# EAGLE board adc (EAGLE 6.5.0), part 1 of 2
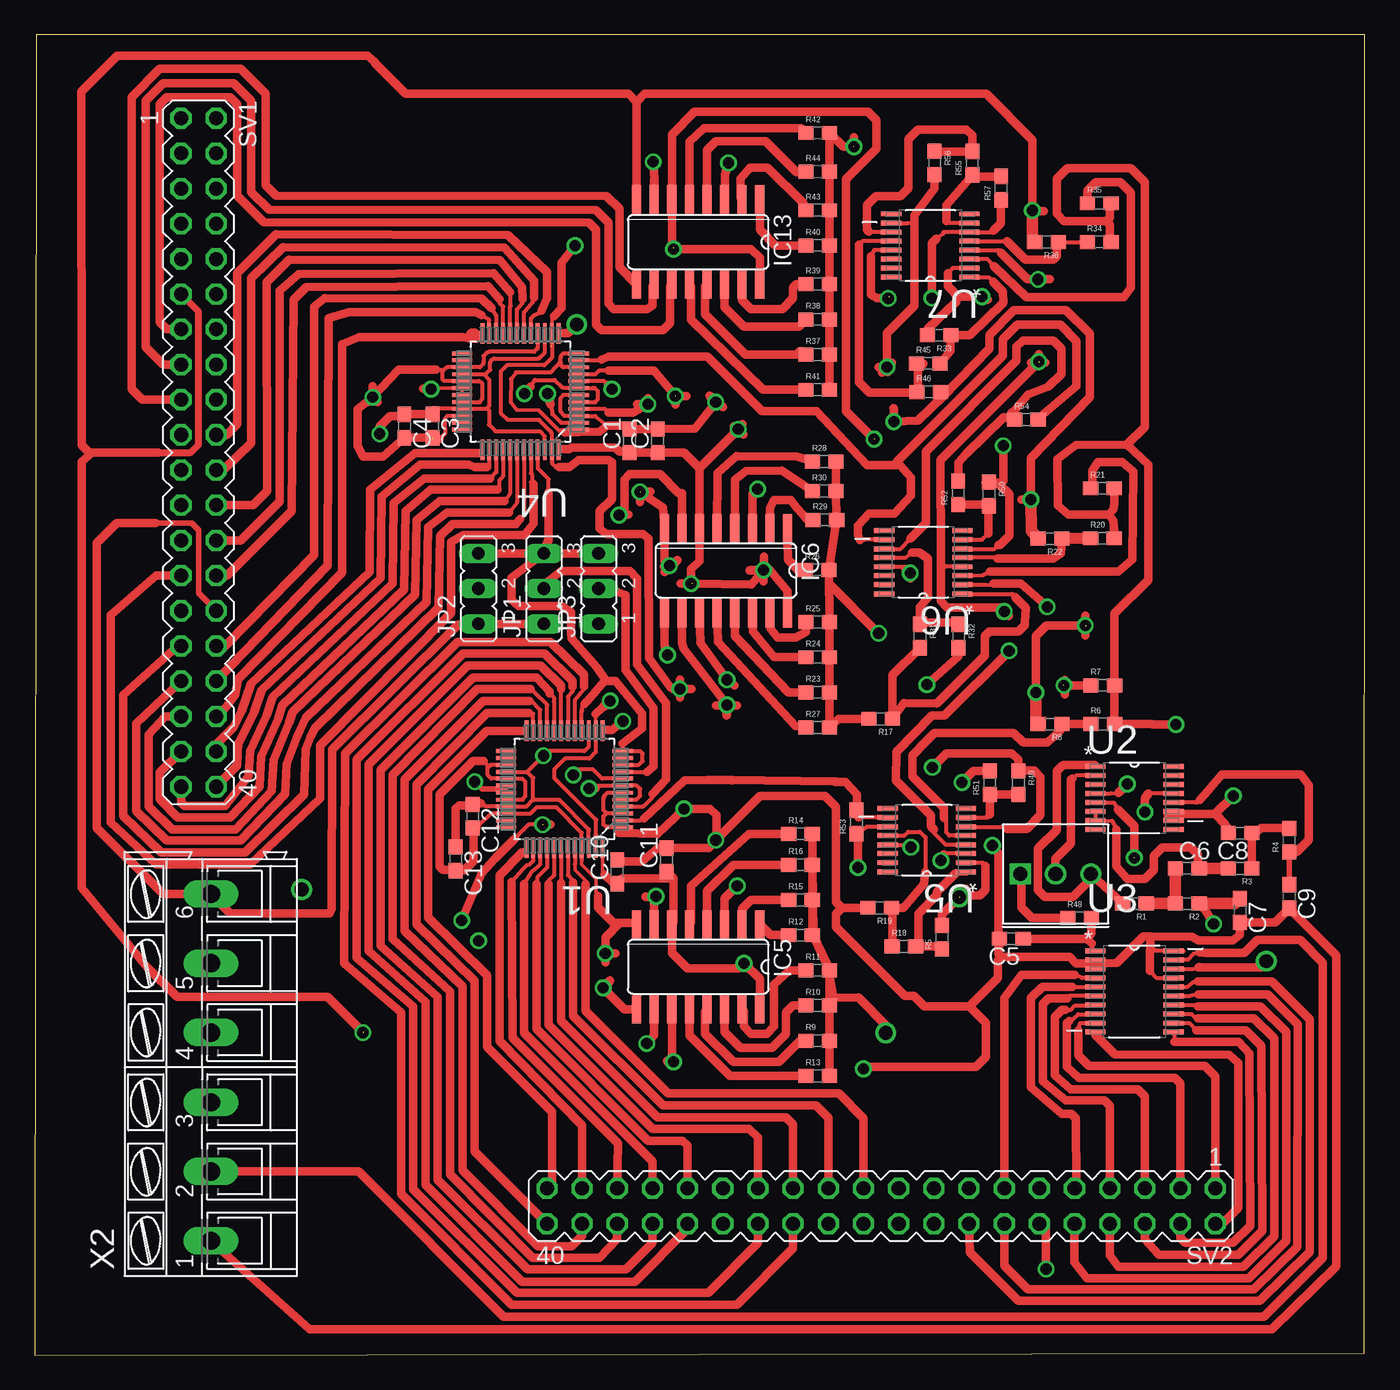
[diagram p2: board, top side]
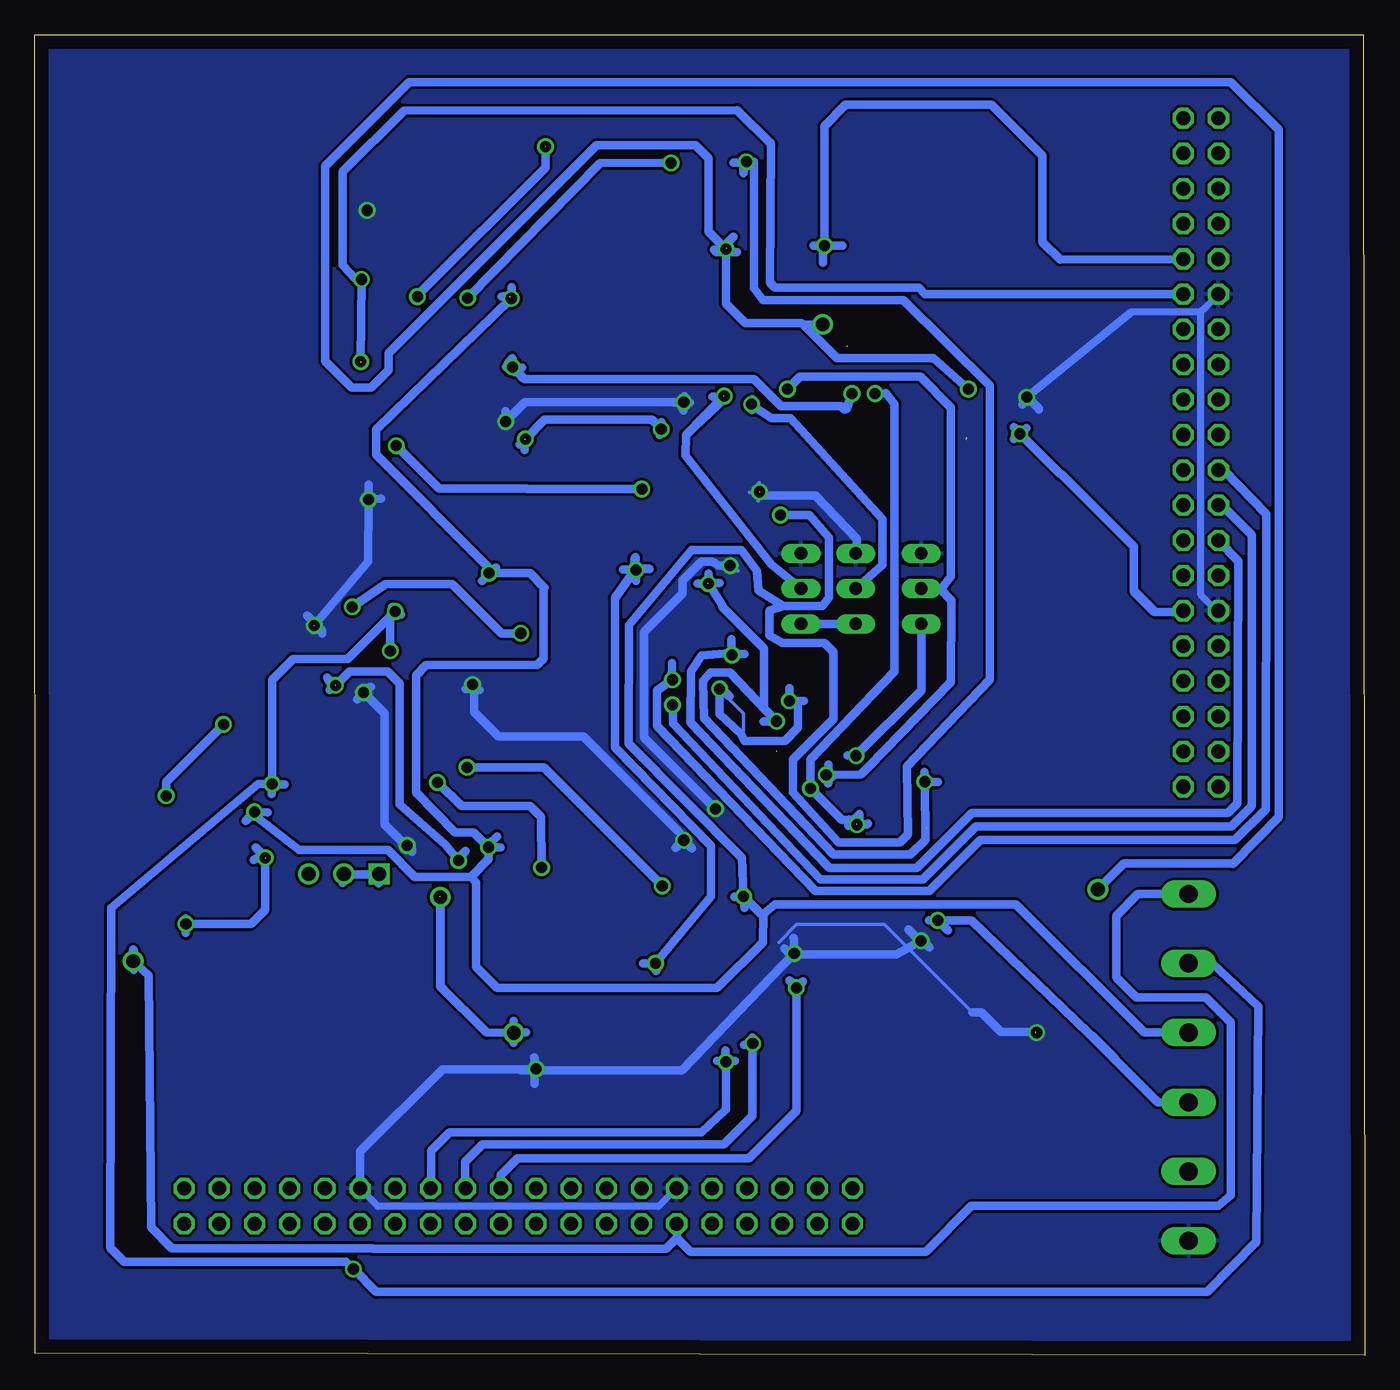
[diagram p3: board, bottom side, seen from below]

Size 96.04 x 95.34 mm. Coordinates in mm from the lower left corner, seen from the top.
Outline: 0,0 95.99,0.13 96.04,95.34 0.13,95.34 0,0
Copper layers (1*16): Top 0.035mm / dielectric 1.5mm / Bottom 0.035mm
Design rules "default *": minimum track width 10mil, minimum drill 24mil, track to track 8mil, track to pad 8mil, pad to pad 8mil, via to via 8mil, smd to smd 8mil, copper to edge 40mil, drill to drill 8mil, minimum pad ring 10mil, minimum via ring 8mil, stop-mask expansion 4mil, vias tented up to drill 0mil, thermal gap 10mil

## Footprints (pad centres in the part's own frame; a part is rotated, then mirrored left to right if it is on the bottom)
C0603 = smd 1.1 x 1: 1 -0.85,0; 2 0.85,0
SO16 = smd 0.66 x 2.032: 1 -4.445,-3.073; 2 -3.175,-3.073; 3 -1.905,-3.073; 4 -0.635,-3.073; 5 0.635,-3.073; 6 1.905,-3.073; 7 3.175,-3.073; 8 4.445,-3.073; 9 4.445,3.073; 10 3.175,3.073; 11 1.905,3.073; 12 0.635,3.073; 13 -0.635,3.073; 14 -1.905,3.073; 15 -3.175,3.073; 16 -4.445,3.073
JP2 = drill 0.914 long: 1 -2.54,0; 2 0,0; 3 2.54,0
0603 = smd 1.1 x 1: 1 -0.85,0; 2 0.85,0
MA20-2 = drill 1.016 octagon: 1 -24.13,-1.27; 2 -24.13,1.27; 3 -21.59,-1.27; 4 -21.59,1.27; 5 -19.05,-1.27; 6 -19.05,1.27; 7 -16.51,-1.27; 8 -16.51,1.27; 9 -13.97,-1.27; 10 -13.97,1.27; 11 -11.43,-1.27; 12 -11.43,1.27; 13 -8.89,-1.27; 14 -8.89,1.27; 15 -6.35,-1.27; 16 -6.35,1.27; 17 -3.81,-1.27; 18 -3.81,1.27; 19 -1.27,-1.27; 20 -1.27,1.27; 21 1.27,-1.27; 22 1.27,1.27; 23 3.81,-1.27; 24 3.81,1.27; 25 6.35,-1.27; 26 6.35,1.27; 27 8.89,-1.27; 28 8.89,1.27; 29 11.43,-1.27; 30 11.43,1.27; 31 13.97,-1.27; 32 13.97,1.27; 33 16.51,-1.27; 34 16.51,1.27; 35 19.05,-1.27; 36 19.05,1.27; 37 21.59,-1.27; 38 21.59,1.27; 39 24.13,-1.27; 40 24.13,1.27
QFP50P900X900X160-48N = smd 1.473 x 0.279: 1 -4.216,2.743; 2 -4.216,2.261; 3 -4.216,1.753; 4 -4.216,1.245; 5 -4.216,0.762; 6 -4.216,0.254; 7 -4.216,-0.254; 8 -4.216,-0.762; 9 -4.216,-1.245; 10 -4.216,-1.753; 11 -4.216,-2.261; 12 -4.216,-2.743; 25 4.216,-2.743; 26 4.216,-2.261; 27 4.216,-1.753; 28 4.216,-1.245; 29 4.216,-0.762; 30 4.216,-0.254; 31 4.216,0.254; 32 4.216,0.762; 33 4.216,1.245; 34 4.216,1.753; 35 4.216,2.261; 36 4.216,2.743 | smd 0.279 x 1.473: 13 -2.743,-4.216; 14 -2.261,-4.216; 15 -1.753,-4.216; 16 -1.245,-4.216; 17 -0.762,-4.216; 18 -0.254,-4.216; 19 0.254,-4.216; 20 0.762,-4.216; 21 1.245,-4.216; 22 1.753,-4.216; 23 2.261,-4.216; 24 2.743,-4.216; 37 2.743,4.216; 38 2.261,4.216; 39 1.753,4.216; 40 1.245,4.216; 41 0.762,4.216; 42 0.254,4.216; 43 -0.254,4.216; 44 -0.762,4.216; 45 -1.245,4.216; 46 -1.753,4.216; 47 -2.261,4.216; 48 -2.743,4.216
SOP65P640X120-16N = smd 1.473 x 0.356: 1 -2.819,2.286; 2 -2.819,1.626; 3 -2.819,0.965; 4 -2.819,0.33; 5 -2.819,-0.33; 6 -2.819,-0.965; 7 -2.819,-1.626; 8 -2.819,-2.286; 9 2.819,-2.286; 10 2.819,-1.626; 11 2.819,-0.965; 12 2.819,-0.33; 13 2.819,0.33; 14 2.819,0.965; 15 2.819,1.626; 16 2.819,2.286
SOP65P640X120-20N = smd 1.473 x 0.356: 1 -2.819,2.921; 2 -2.819,2.286; 3 -2.819,1.626; 4 -2.819,0.965; 5 -2.819,0.33; 6 -2.819,-0.33; 7 -2.819,-0.965; 8 -2.819,-1.626; 9 -2.819,-2.286; 10 -2.819,-2.921; 11 2.819,-2.921; 12 2.819,-2.286; 13 2.819,-1.626; 14 2.819,-0.965; 15 2.819,-0.33; 16 2.819,0.33; 17 2.819,0.965; 18 2.819,1.626; 19 2.819,2.286; 20 2.819,2.921
3362U = drill 1.016 square: P$1 0,2.54 | drill 1.016: P$2 2.54,2.54; P$3 5.08,2.54
AK300/6 = drill 1.321 long: 1 -12.522,0; 2 -7.518,0; 3 -2.515,0; 4 2.515,0; 5 7.518,0; 6 12.522,0

## Placement (x,y rotation side)
C1  10nf  [C0603]  42.95,66.01 90 top
C2  10uf  [C0603]  44.98,66.01 90 top
C3  10nf  [C0603]  28.73,67.08 270 top
C4  10uf  [C0603]  26.7,67.08 270 top
C5  10nf  [C0603]  70.51,30.07 180 top
C6  10nf  [C0603]  83.21,35.15 0 top
C7  10nf  [C0603]  87.02,32.11 270 top
C8  10nf  [C0603]  87.02,37.69 180 top
C9  10nf  [C0603]  90.58,33.12 270 top
C10  10nf  [C0603]  42.06,34.9 90 top
C11  10uf  [C0603]  45.62,35.76 90 top
C12  10nf  [C0603]  31.62,38.91 270 top
C13  10uf  [C0603]  30.4,35.84 270 top
IC5  4051D  [SO16]  47.9,28.04 180 top
IC6  4051D  [SO16]  49.91,56.64 180 top
IC13  4051D  [SO16]  47.9,80.37 180 top
JP1  [JP2]  36.75,55.35 90 top
JP2  [JP2]  32.03,55.35 90 top
JP3  [JP2]  40.72,55.35 90 top
R1  [0603]  79.4,32.61 180 top
R2  [0603]  83.21,32.61 180 top
R3  [0603]  87.02,35.15 180 top
R4  [0603]  90.58,37.19 90 top
R5  [0603]  65.51,30.18 90 top
R6  [0603]  77.11,45.57 0 top
R7  [0603]  77.11,48.36 0 top
R8  [0603]  73.3,45.57 180 top
R9  [0603]  56.54,22.71 0 top
R10  [0603]  56.54,25.25 0 top
R11  [0603]  56.54,27.79 0 top
R12  [0603]  55.3,30.33 0 top
R13  [0603]  56.54,20.17 0 top
R14  [0603]  55.3,37.64 0 top
R15  [0603]  55.3,32.87 0 top
R16  [0603]  55.3,35.41 0 top
R17  [0603]  61.09,45.95 180 top
R18  [0603]  62.76,29.51 0 top
R19  [0603]  61.01,32.31 180 top
R20  [0603]  77.09,58.98 0 top
R21  [0603]  77.09,62.59 0 top
R22  [0603]  73.3,58.95 180 top
R23  [0603]  56.54,47.85 0 top
R24  [0603]  56.54,50.39 0 top
R25  [0603]  56.54,52.93 0 top
R26  [0603]  56.49,56.69 0 top
R27  [0603]  56.54,45.31 0 top
R28  [0603]  57,64.52 0 top
R29  [0603]  57.05,60.3 0 top
R30  [0603]  57,62.38 0 top
R31  [0603]  63.91,51.92 270 top
R32  [0603]  66.7,51.92 270 top
R33  [0603]  65.3,73.63 180 top
R34  [0603]  76.86,80.37 0 top
R35  [0603]  76.86,83.16 0 top
R36  [0603]  73.05,80.37 180 top
R37  [0603]  56.54,72.24 0 top
R38  [0603]  56.54,74.78 0 top
R39  [0603]  56.54,77.32 0 top
R40  [0603]  56.54,80.11 0 top
R41  [0603]  56.54,69.7 0 top
R42  [0603]  56.54,88.24 0 top
R43  [0603]  56.54,82.65 0 top
R44  [0603]  56.54,85.45 0 top
R45  [0603]  64.52,71.6 0 top
R46  [0603]  64.54,69.55 0 top
R48  [0603]  75.44,31.57 0 top
R49  [0603]  71.02,41.33 270 top
R50  [0603]  68.88,62.18 270 top
R51  [0603]  68.96,41.33 90 top
R52  [0603]  66.67,62.26 90 top
R53  [0603]  59.33,38.51 90 top
R54  [0603]  71.6,67.54 0 top
R55  [0603]  67.69,86.06 90 top
R56  [0603]  64.97,86.08 270 top
R57  [0603]  69.77,84.25 90 top
SV1  [MA20-2]  11.84,65.18 270 top
SV2  [MA20-2]  61.11,10.77 180 top
U1  ADV7173KSTZ  [QFP50P900X900X160-48N]  38.25,40.87 180 top
U2  AD5308ARUZ  [SOP65P640X120-16N]  79.4,40.23 0 top
U3  AD7927BRUZ  [SOP65P640X120-20N]  79.4,26.26 0 top
U4  ADV7173KSTZ  [QFP50P900X900X160-48N]  35.08,69.57 180 top
U5  AD5308ARUZ  [SOP65P640X120-16N]  64.41,37.19 180 top
U6  AD5308ARUZ  [SOP65P640X120-16N]  64.16,57.25 180 top
U7  AD5308ARUZ  [SOP65P640X120-16N]  64.67,80.11 180 top
U$1  POT100K_3362U  [3362U]  71.17,32.21 0 top
X2  [AK300/6]  12.73,20.78 90 top